# Altium schematic sheet INTERFACE_PWR_LS_HS.SchDoc
size A4
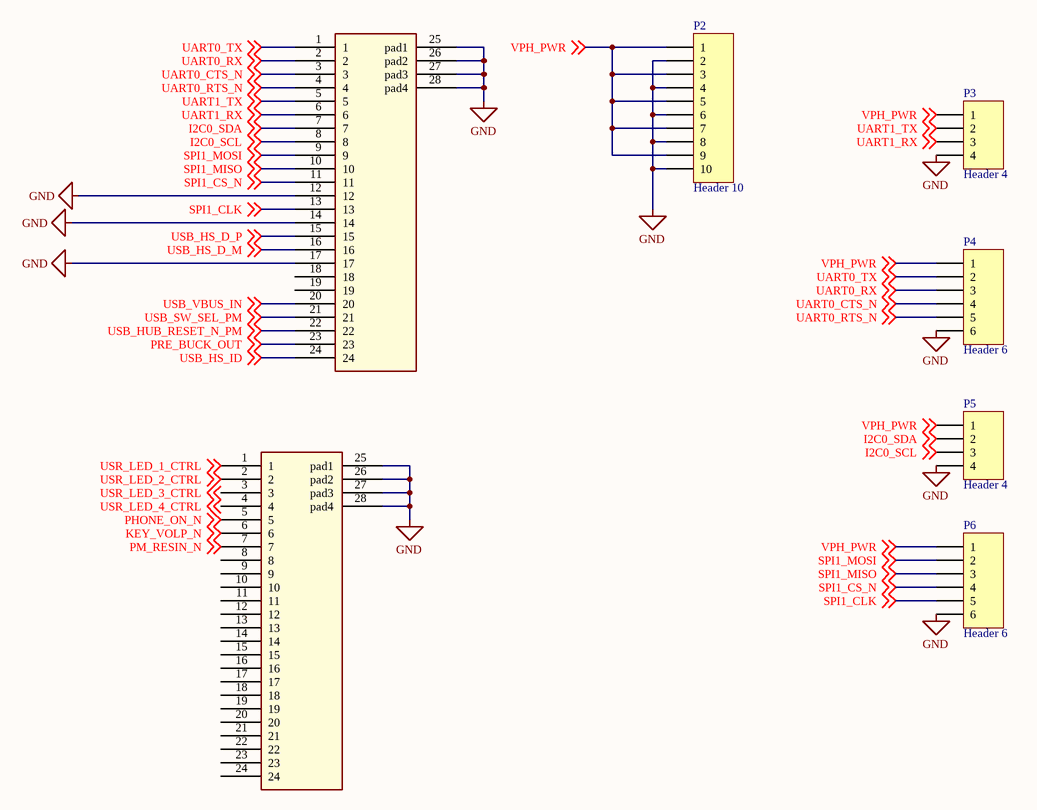
[diagram p0: INTERFACE_PWR_LS_HS.SchDoc]

## Parts
CN1  CON24_0  (value not drawn)
CN2  CON24_0  (value not drawn)
P2  Header 10  [HDR1X10]
P3  Header 4  [HDR1X4]
P4  Header 6  [HDR1X6]
P5  Header 4  [HDR1X4]
P6  Header 6  [HDR1X6]

## Nets
GND: CN1.12 CN1.14 CN1.17 CN1.25(pad1) CN1.26(pad2) CN1.27(pad3) CN1.28(pad4) CN2.25(pad1) CN2.26(pad2) CN2.27(pad3) CN2.28(pad4) P2.2 P2.4 P2.6 P2.8 P2.10 P3.4 P4.6 P5.4 P6.6
I2C0_SCL: CN1.8 P5.3 ; off-sheet I2C0_SCL
I2C0_SDA: CN1.7 P5.2 ; off-sheet I2C0_SDA
KEY_VOLP_N: CN2.6 ; off-sheet KEY_VOLP_N
PHONE_ON_N: CN2.5 ; off-sheet PHONE_ON_N
PM_RESIN_N: CN2.7 ; off-sheet PM_RESIN_N
PRE_BUCK_OUT: CN1.23 ; off-sheet PRE_BUCK_OUT
SPI1_CLK: CN1.13 P6.5 ; off-sheet SPI1_CLK
SPI1_CS_N: CN1.11 P6.4 ; off-sheet SPI1_CS_N
SPI1_MISO: CN1.10 P6.3 ; off-sheet SPI1_MISO
SPI1_MOSI: CN1.9 P6.2 ; off-sheet SPI1_MOSI
UART0_CTS_N: CN1.3 P4.4 ; off-sheet UART0_CTS_N
UART0_RTS_N: CN1.4 P4.5 ; off-sheet UART0_RTS_N
UART0_RX: CN1.2 P4.3 ; off-sheet UART0_RX
UART0_TX: CN1.1 P4.2 ; off-sheet UART0_TX
UART1_RX: CN1.6 P3.3 ; off-sheet UART1_RX
UART1_TX: CN1.5 P3.2 ; off-sheet UART1_TX
USB_HS_D_M: CN1.16 ; off-sheet USB_HS_D_M
USB_HS_D_P: CN1.15 ; off-sheet USB_HS_D_P
USB_HS_ID: CN1.24 ; off-sheet USB_HS_ID
USB_HUB_RESET_N_PM: CN1.22 ; off-sheet USB_HUB_RESET_N_PM
USB_SW_SEL_PM: CN1.21 ; off-sheet USB_SW_SEL_PM
USB_VBUS_IN: CN1.20 ; off-sheet USB_VBUS_IN
USR_LED_1_CTRL: CN2.1 ; off-sheet USR_LED_1_CTRL
USR_LED_2_CTRL: CN2.2 ; off-sheet USR_LED_2_CTRL
USR_LED_3_CTRL: CN2.3 ; off-sheet USR_LED_3_CTRL
USR_LED_4_CTRL: CN2.4 ; off-sheet USR_LED_4_CTRL
VPH_PWR: P2.1 P2.3 P2.5 P2.7 P2.9 P3.1 P4.1 P5.1 P6.1 ; off-sheet VPH_PWR

Not connected (* = marked no-connect by the designer): CN1 18 19; CN2 8 9 10 11 12 13 14 15 16 17 18 19 20 21 22 23 24

## Library data of the parts
P2 = Header 10: Header, 10-Pin; LatestRevisionDate: 17-Jul-2002; LatestRevisionNote: Re-released for DXP Platform.; Publisher: Altium Limited
P3 P5 = Header 4: Header, 4-Pin; LatestRevisionDate: 17-Jul-2002; LatestRevisionNote: Re-released for DXP Platform.; Publisher: Altium Limited
P4 P6 = Header 6: Header, 6-Pin; LatestRevisionDate: 17-Jul-2002; LatestRevisionNote: Re-released for DXP Platform.; Publisher: Altium Limited